# Altium schematic sheet USB_OUT_B.SchDoc
size A; SheetNumber: 12; SheetTotal: 12
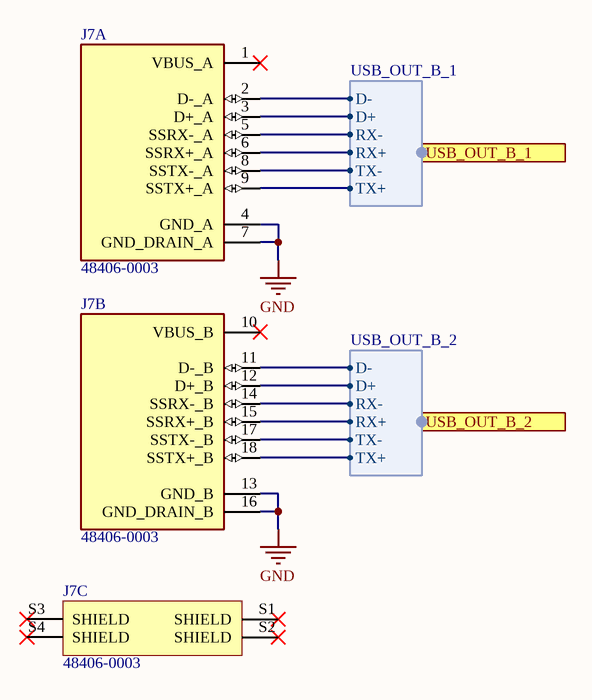
[diagram p0: USB_OUT_B.SchDoc]

## Parts
J7  48406-0003  [MOLEX_48406]  (parts A,B,C of 3)

## Ports
USB_OUT_B_1 (harness USB_OUT_B_1, see USB[3B], USB_SWITCH_B[3B]), USB_OUT_B_2 (harness USB_OUT_B_2, see USB[3B], USB_SWITCH_B[3B])

## Harnesses
USB_OUT_B_1: D+, D-, RX-, RX+, TX-, TX+
USB_OUT_B_2: D+, D-, RX-, RX+, TX-, TX+

## Nets
GND: J7.4(GND_A) J7.7(GND_DRAIN_A) J7.13(GND_B) J7.16(GND_DRAIN_B)
NetJ7_2: J7.2(D-_A) ; port USB_OUT_B_1.D-
NetJ7_3: J7.3(D+_A) ; port USB_OUT_B_1.D+
NetJ7_5: J7.5(SSRX-_A) ; port USB_OUT_B_1.RX-
NetJ7_6: J7.6(SSRX+_A) ; port USB_OUT_B_1.RX+
NetJ7_8: J7.8(SSTX-_A) ; port USB_OUT_B_1.TX-
NetJ7_9: J7.9(SSTX+_A) ; port USB_OUT_B_1.TX+
NetJ7_11: J7.11(D-_B) ; port USB_OUT_B_2.D-
NetJ7_12: J7.12(D+_B) ; port USB_OUT_B_2.D+
NetJ7_14: J7.14(SSRX-_B) ; port USB_OUT_B_2.RX-
NetJ7_15: J7.15(SSRX+_B) ; port USB_OUT_B_2.RX+
NetJ7_17: J7.17(SSTX-_B) ; port USB_OUT_B_2.TX-
NetJ7_18: J7.18(SSTX+_B) ; port USB_OUT_B_2.TX+

Not connected (* = marked no-connect by the designer): J7 1(VBUS_A)* 10(VBUS_B)* S1(SHIELD)* S2(SHIELD)* S3(SHIELD)* S4(SHIELD)*

## Library data of the parts
J7 = 48406-0003: USB-A (USB TYPE-A), Stacked USB 3.2 Gen 1 (USB 3.1 Gen 1, Superspeed (USB 3.0)) Receptacle Connector 18 Position Through Hole, Right Angle; MF: Molex; Package: None; Check_prices: https://www.snapeda.com/parts/48406-0003/Molex/view-part/?ref=eda; Value: *; Price: None; MP: 48406-0003; Purchase-URL: https://pricing.snapeda.com/search/part/48406-0003/?ref=eda; SnapEDA_Link: https://www.snapeda.com/parts/48406-0003/Molex/view-part/?ref=snap; Availability: In Stock